# Altium schematic sheet Telemetry_canbus.SchDoc: Telemetry CANbus
size A4; Organization: Altium Limited; Address1: L3, 12a Rodborough Rd; Address2: Frenchs Forest; Address3: NSW; Address4: Australia 2086; SheetNumber: 2; SheetTotal: 2
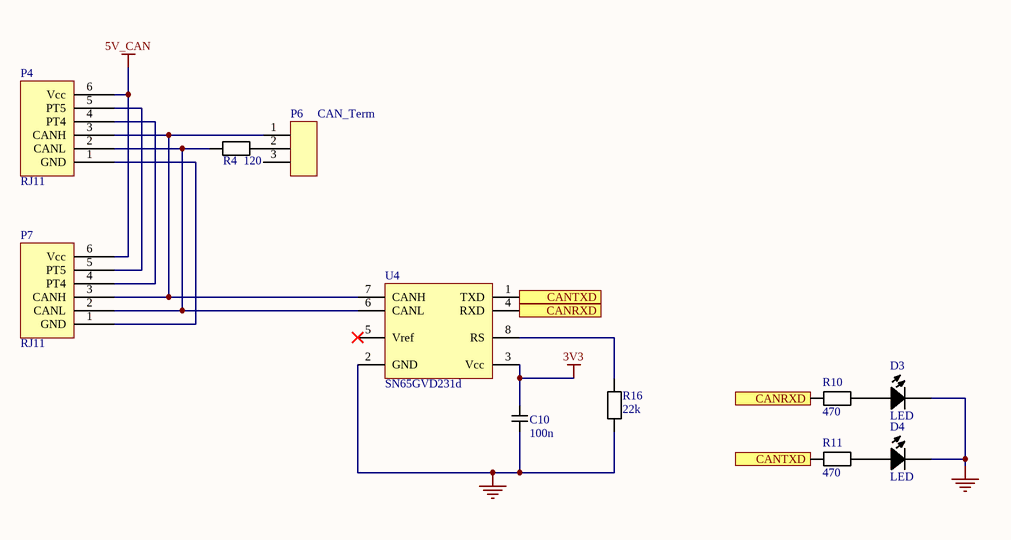
[diagram p0: Telemetry_canbus.SchDoc]

## Parts
C10  value 100n  [C_SMD_0805_pcb]  (hidden comment: SMD)
D3  LED  [D_LED_0805]
D4  LED  [D_LED_0805]
P4  RJ11  [RJ11_Connector]
P6  CAN_Term  [PIN_HEADER_M_1x3]
P7  RJ11  [RJ11_Connector]
R4  value 120  [R_SMD_0805_pcb]  (hidden comment: SMD)
R10  value 470  [R_SMD_0805_pcb]  (hidden comment: SMD)
R11  value 470  [R_SMD_0805_pcb]  (hidden comment: SMD)
R16  value 22k  [R_SMD_0805_pcb]  (hidden comment: SMD)
U4  SN65GVD231d  [SN65HVD231D_SMD]

## Ports
CANRXD, CANRXD (in), CANTXD, CANTXD (out)

## Nets
3V3: C10.1 U4.3(Vcc)
5V_CAN: P4.6(Vcc) P7.6(Vcc)
GND: C10.2 D3.2 D4.2 R16.1 U4.2(GND)
CANRXD: R10.1 U4.4(RXD) ; port CANRXD
CANTXD: R11.1 U4.1(TXD) ; port CANTXD
NetD3_1: D3.1 R10.2
NetD4_1: D4.1 R11.2
NetP4_1: P4.1(GND) P7.1(GND)
NetP4_2: P4.2(CANL) P7.2(CANL) R4.1 U4.6(CANL)
NetP4_3: P4.3(CANH) P6.1 P7.3(CANH) U4.7(CANH)
NetP4_4: P4.4(PT4) P7.4(PT4)
NetP4_5: P4.5(PT5) P7.5(PT5)
NetP6_2: P6.2 R4.2
NetR16_2: R16.2 U4.8(RS)

Not connected (* = marked no-connect by the designer): P6 3; U4 5(Vref)*

## Notes on the sheet
- Title
- Size:
- Date:
- A4
- Number:
- Time:
- Revision:
- Sheet
- of
- File:

## Library data of the parts
C10 = C_SMD_0805: Supplier 1: *; Supplier Part Number 1: *
D3 D4 = D_LED_0805_SMD
P4 P7 = RJ11_Connector: Supplier Part Number 1: *; Supplier 1: *
P6 = PIN_HEADER_M_1x3
R4 R10 R11 R16 = R_SMD_0805: Supplier 1: *; Supplier Part Number 1: *
U4 = SN65HVD231D_SMD: Supplier 1: *; Supplier Part Number 1: *